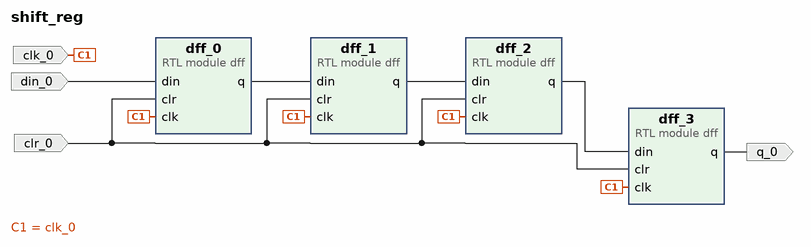
[diagram p0: block diagram of the top level]
# Vivado block design shift_reg, xc7z010clg400-1, Vivado 2019.1
create_bd_design shift_reg

create_bd_port -dir I din_0
create_bd_port -dir I -type clk clk_0
create_bd_port -dir I clr_0
create_bd_port -dir O q_0

create_bd_cell -type module -reference dff dff_0
create_bd_cell -type module -reference dff dff_1
create_bd_cell -type module -reference dff dff_2
create_bd_cell -type module -reference dff dff_3

# ---- connections ----

connect_bd_net [get_bd_pins dff_0/q] [get_bd_pins dff_1/din]
connect_bd_net [get_bd_pins dff_1/q] [get_bd_pins dff_2/din]
connect_bd_net [get_bd_pins dff_2/q] [get_bd_pins dff_3/din]
connect_bd_net -net din_0_1 [get_bd_ports din_0] [get_bd_pins dff_0/din]
connect_bd_net -net clk_0_1 [get_bd_ports clk_0] [get_bd_pins dff_0/clk] [get_bd_pins dff_1/clk] [get_bd_pins dff_2/clk] [get_bd_pins dff_3/clk]
connect_bd_net -net clr_0_1 [get_bd_ports clr_0] [get_bd_pins dff_0/clr] [get_bd_pins dff_1/clr] [get_bd_pins dff_2/clr] [get_bd_pins dff_3/clr]
connect_bd_net [get_bd_pins dff_3/q] [get_bd_ports q_0]

validate_bd_design
save_bd_design
